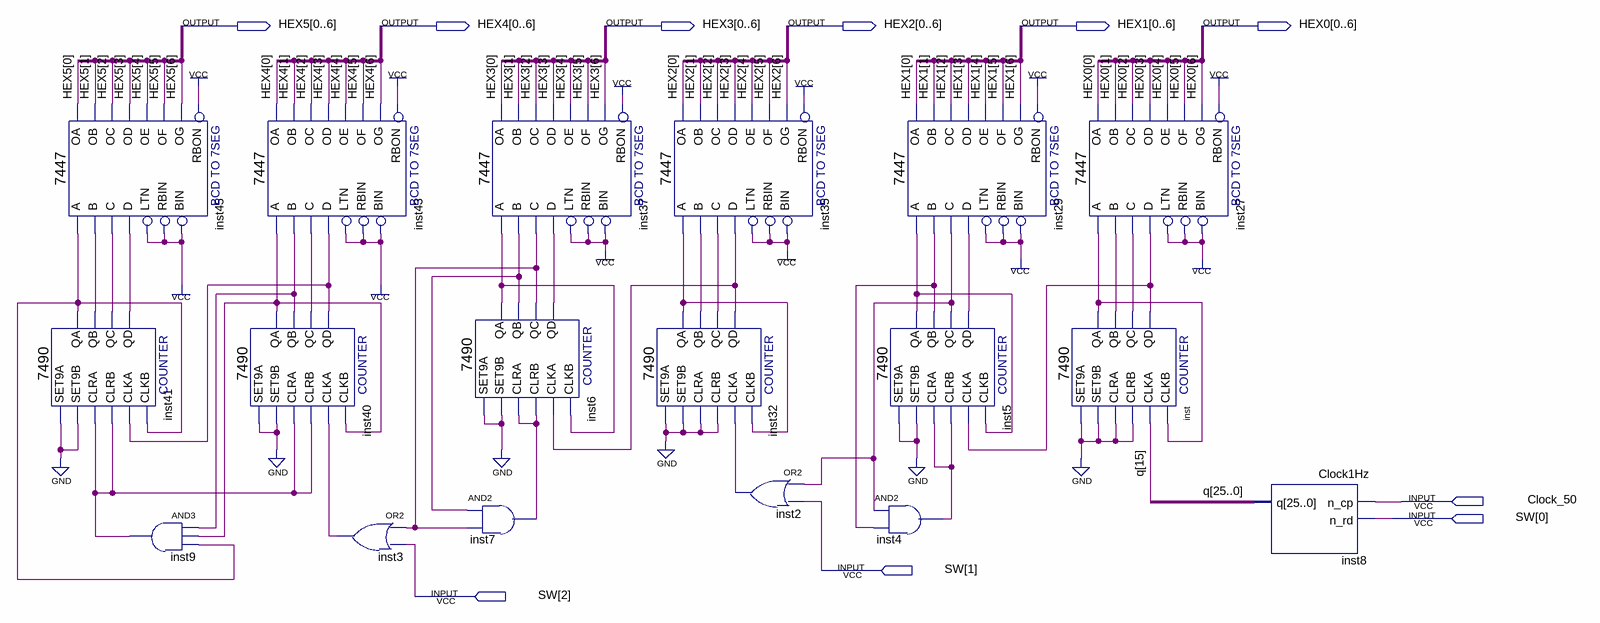
[diagram p0: schematic sheet]
// Quartus schematic Set_Clock.bdf as structural Verilog: 18 symbols, 10 pins
module Set_Clock (
  input  Clock_50,
  input  [2:0] SW,
  output [0:6] HEX5,
  output [0:6] HEX4,
  output [0:6] HEX3,
  output [0:6] HEX2,
  output [0:6] HEX1,
  output [0:6] HEX0
);

  wire inst2_out, inst3_out, inst4_out, inst5_qa, inst5_qb, inst5_qc, inst5_qd, inst6_qa, inst6_qb, inst6_qc,
       inst6_qd, inst7_out, inst9_out, inst27_rbon, inst29_rbon, inst32_qa, inst32_qb, inst32_qc, inst32_qd,
       inst35_rbon, inst37_rbon, inst40_qa, inst40_qb, inst40_qc, inst40_qd, inst41_qa, inst41_qb, inst41_qc,
       inst41_qd, inst43_rbon, inst45_rbon, inst_qa, inst_qb, inst_qc, inst_qd;
  wire [25:0] q;

  \7447  inst45 (
    .LTN(1'b1), .B(inst41_qb), .C(inst41_qc), .D(inst41_qd), .RBIN(1'b1), .BIN(1'b1), .A(inst41_qa),
    .OB(HEX5[1]), .OC(HEX5[2]), .OE(HEX5[4]), .OD(HEX5[3]), .OF(HEX5[5]), .OG(HEX5[6]), .OA(HEX5[0]),
    .RBON(inst45_rbon));
  \7490  inst41 (
    .SET9A(1'b0), .CLRA(inst9_out), .SET9B(1'b0), .CLKB(inst41_qa), .CLKA(inst40_qd), .CLRB(inst9_out),
    .QD(inst41_qd), .QA(inst41_qa), .QB(inst41_qb), .QC(inst41_qc));
  and inst9 (inst9_out, inst40_qb, inst40_qa, inst41_qa);
  \7447  inst43 (
    .LTN(1'b1), .B(inst40_qb), .C(inst40_qc), .D(inst40_qd), .RBIN(1'b1), .BIN(1'b1), .A(inst40_qa),
    .OB(HEX4[1]), .OC(HEX4[2]), .OE(HEX4[4]), .OD(HEX4[3]), .OF(HEX4[5]), .OG(HEX4[6]), .OA(HEX4[0]),
    .RBON(inst43_rbon));
  \7490  inst40 (
    .SET9A(1'b0), .CLRA(inst9_out), .SET9B(1'b0), .CLKB(inst40_qa), .CLKA(inst3_out), .CLRB(inst9_out),
    .QD(inst40_qd), .QA(inst40_qa), .QB(inst40_qb), .QC(inst40_qc));
  or inst3 (inst3_out, inst6_qc, SW[2]);
  \7490  inst6 (
    .SET9A(1'b0), .CLRA(inst7_out), .SET9B(1'b0), .CLKB(inst6_qa), .CLKA(inst32_qd), .CLRB(inst7_out),
    .QD(inst6_qd), .QA(inst6_qa), .QB(inst6_qb), .QC(inst6_qc));
  and inst7 (inst7_out, inst6_qb, inst6_qc);
  \7447  inst37 (
    .LTN(1'b1), .B(inst6_qb), .C(inst6_qc), .D(inst6_qd), .RBIN(1'b1), .BIN(1'b1), .A(inst6_qa),
    .OB(HEX3[1]), .OC(HEX3[2]), .OE(HEX3[4]), .OD(HEX3[3]), .OF(HEX3[5]), .OG(HEX3[6]), .OA(HEX3[0]),
    .RBON(inst37_rbon));
  \7447  inst35 (
    .LTN(1'b1), .B(inst32_qb), .C(inst32_qc), .D(inst32_qd), .RBIN(1'b1), .BIN(1'b1), .A(inst32_qa),
    .OB(HEX2[1]), .OC(HEX2[2]), .OE(HEX2[4]), .OD(HEX2[3]), .OF(HEX2[5]), .OG(HEX2[6]), .OA(HEX2[0]),
    .RBON(inst35_rbon));
  \7490  inst32 (
    .SET9A(1'b0), .CLRA(1'b0), .SET9B(1'b0), .CLKB(inst32_qa), .CLKA(inst2_out), .CLRB(1'b0), .QD(inst32_qd),
    .QA(inst32_qa), .QB(inst32_qb), .QC(inst32_qc));
  or inst2 (inst2_out, inst5_qc, SW[1]);
  \7490  inst5 (
    .SET9A(1'b0), .CLRA(inst4_out), .SET9B(1'b0), .CLKB(inst5_qa), .CLKA(inst_qd), .CLRB(inst4_out),
    .QD(inst5_qd), .QA(inst5_qa), .QB(inst5_qb), .QC(inst5_qc));
  and inst4 (inst4_out, inst5_qc, inst5_qb);
  \7447  inst29 (
    .LTN(1'b1), .B(inst5_qb), .C(inst5_qc), .D(inst5_qd), .RBIN(1'b1), .BIN(1'b1), .A(inst5_qa),
    .OB(HEX1[1]), .OC(HEX1[2]), .OE(HEX1[4]), .OD(HEX1[3]), .OF(HEX1[5]), .OG(HEX1[6]), .OA(HEX1[0]),
    .RBON(inst29_rbon));
  \7447  inst27 (
    .LTN(1'b1), .B(inst_qb), .C(inst_qc), .D(inst_qd), .RBIN(1'b1), .BIN(1'b1), .A(inst_qa), .OB(HEX0[1]),
    .OC(HEX0[2]), .OE(HEX0[4]), .OD(HEX0[3]), .OF(HEX0[5]), .OG(HEX0[6]), .OA(HEX0[0]), .RBON(inst27_rbon));
  \7490  inst (
    .SET9A(1'b0), .CLRA(1'b0), .SET9B(1'b0), .CLKB(inst_qa), .CLKA(q[15]), .CLRB(1'b0), .QD(inst_qd),
    .QA(inst_qa), .QB(inst_qb), .QC(inst_qc));
  Clock1Hz inst8 (.n_cp(Clock_50), .n_rd(SW[0]), .q(q));
  // also tied to VCC on the sheet: {inst27_rbon, inst29_rbon, inst43_rbon, inst45_rbon, inst37_rbon, inst35_rbon}
endmodule
